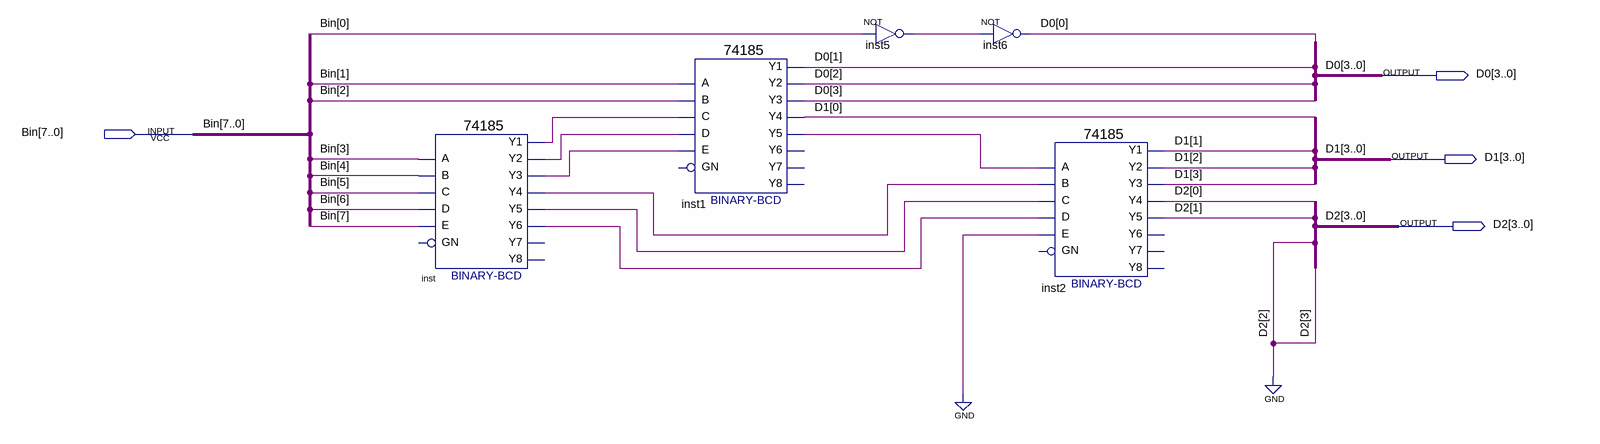
[diagram p0: schematic sheet]
// Quartus schematic BinBCD.bdf as structural Verilog: 5 symbols, 4 pins
module BinBCD (
  input  [7:0] Bin,
  output [3:0] D0,
  output [3:0] D1,
  output [3:0] D2
);

  wire inst1_y5, inst5_out, inst_y1, inst_y2, inst_y3, inst_y4, inst_y5, inst_y6;

  \74185  inst (
    .A(Bin[3]), .B(Bin[4]), .D(Bin[6]), .C(Bin[5]), .E(Bin[7]), .Y1(inst_y1), .Y3(inst_y3), .Y2(inst_y2),
    .Y5(inst_y5), .Y4(inst_y4), .Y6(inst_y6));  // open: GN, Y8, Y7
  \74185  inst1 (
    .A(Bin[1]), .B(Bin[2]), .D(inst_y2), .C(inst_y1), .E(inst_y3), .Y1(D0[1]), .Y3(D0[3]), .Y2(D0[2]),
    .Y5(inst1_y5), .Y4(D1[0]));  // open: GN, Y6, Y8, Y7
  not inst5 (inst5_out, Bin[0]);
  not inst6 (D0[0], inst5_out);
  \74185  inst2 (
    .A(inst1_y5), .B(inst_y4), .D(inst_y6), .C(inst_y5), .E(1'b0), .Y1(D1[1]), .Y3(D1[3]), .Y2(D1[2]),
    .Y5(D2[1]), .Y4(D2[0]));  // open: GN, Y6, Y8, Y7

  assign D2[3:2] = 2'b00;
endmodule
